# Altium schematic sheet revision_history.SchDoc
size A4; Date: 10/27/2015; Engineer: JBayalas; DocumentNumber: 2; Revision: V2.0; SheetNumber: 2; SheetTotal: 14
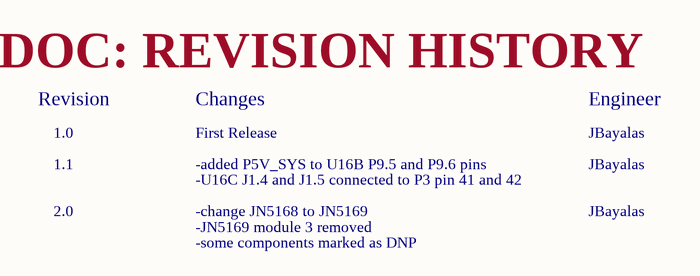
[diagram p0: revision_history.SchDoc]

## Notes on the sheet
- Revision
- Changes
- DOC: REVISION HISTORY
- Engineer
- 1.0
- 1.1
- First Release
- -added P5V_SYS to U16B P9.5 and P9.6 pins
- -U16C J1.4 and J1.5 connected to P3 pin 41 and 42
- JBayalas
- 2.0
- -change JN5168 to JN5169
- -JN5169 module 3 removed
- -some components marked as DNP
- Title:
- Sheet:
- Date:
- of
- Project:
- Revision:
- Engineer:
- Wi4B S.r.l